# EasyEDA Pro project ProProject_Hauptplatine_ESP32.epro, schematic Schematic1_Link
Create Date: 2024-03-31; Page Name: P1; Project Name: Hauptplatine_ESP32; Schematic Name: Schematic1_Link; Update Date: 2024-06-12; Company: EasyEDA.com; Drawn: EasyEDA; Page Size: A4; Part Number: JLCPCB-002; Reviewed: EasyEDA; Version: V0.1
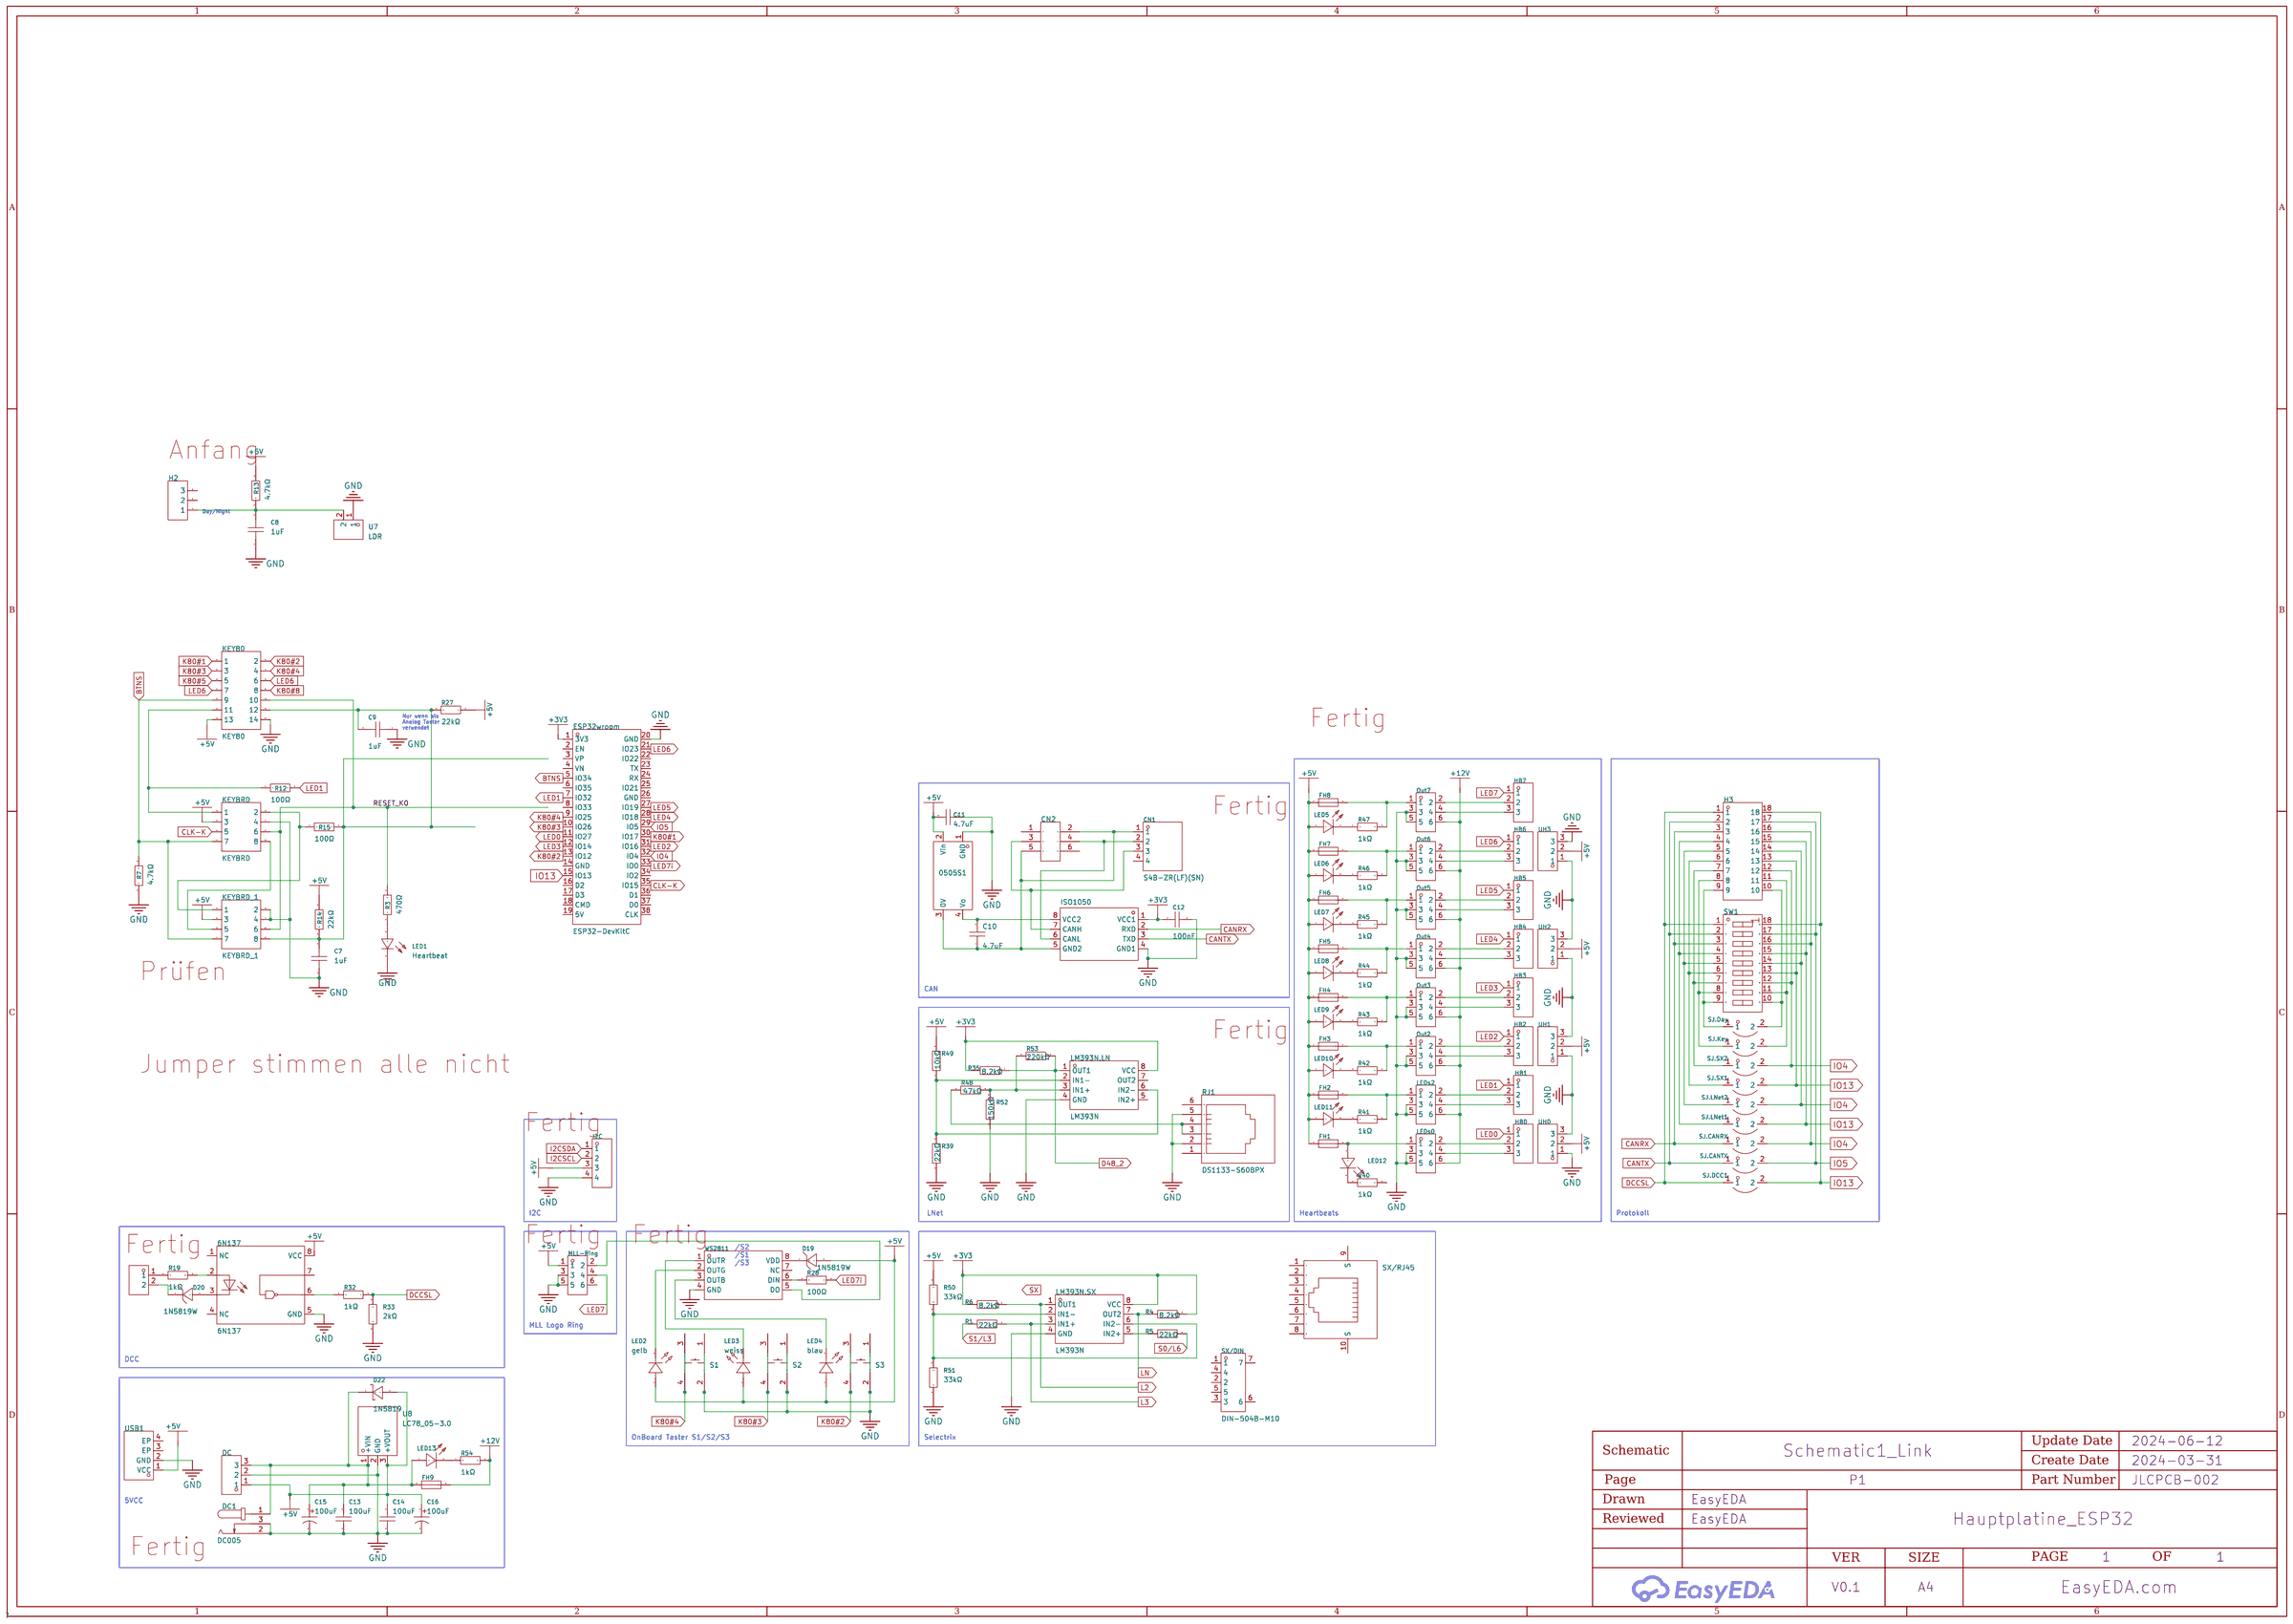
[diagram p7: schematic sheet]

## Parts
6N137  6N137  [DIP-8_L9.8-W6.6-P2.54-LS7.6-BL]
0505S1  B0505S-W5R3  [PWRM-TH_BXXXXS-1WR3]
C7  1uF  [C1206]
C8  1uF  [C1206]
C9  1uF  [C1206]
C10  4.7uF  [C1206]
C11  4.7uF  [C1206]
C12  100nF  [C1206]
C13  100uF  [C1206]
C14  100uF  [C1206]
C15  100uF  [CAP-SMD_BD6.3-L6.6-W6.6-FD]
C16  100uF  [CAP-SMD_BD6.3-L6.6-W6.6-FD]
CN1  S4B-ZR(LF)(SN)  [CONN-TH_S4B-ZR-LF-SN]
CN2  2.54-2*3P弯简牛  [IDC-TH_6P-P2.54-H-R2-C3-S2.54]
D19  1N5819W  [SOD-123_L2.8-W1.8-LS3.7-RD]
D20  1N5819W  [SOD-123_L2.8-W1.8-LS3.7-RD]
D22  1N5819  [SMA_L4.4-W2.6-LS5.0-RD]
DC  DB2ERC-3.5-3P-GN  [CONN-TH_3P-P3.50_DB2ERC-3.5-3P-GN]
DC1  DC005  [DC-IN-TH_DC005]
DCC1  DB2ERC-3.5-2P-GN  [CONN-TH_2P-P3.50_DB2ERC-3.5-2P]
ESP32wroom  ESP32-DevKitC  [BULETM-SMD_ESP32-DEVKITC]
FH1  01550900M  [FUSE-SMD_L9.8-W5.0]
FH2  01550900M  [FUSE-SMD_L9.8-W5.0]
FH3  01550900M  [FUSE-SMD_L9.8-W5.0]
FH4  01550900M  [FUSE-SMD_L9.8-W5.0]
FH5  01550900M  [FUSE-SMD_L9.8-W5.0]
FH6  01550900M  [FUSE-SMD_L9.8-W5.0]
FH7  01550900M  [FUSE-SMD_L9.8-W5.0]
FH8  01550900M  [FUSE-SMD_L9.8-W5.0]
FH9  01550900M  [FUSE-SMD_L9.8-W5.0]
H2  2.54-1*3P针  [HDR-TH_3P-P2.54-V-M-1]
H3  X6521WV-2x09H-C60D30  [HDR-TH_18P-P2.54-V-M-R2-C9-S2.54]
HB0  PM2.54-1*3  [HDR-TH_3P-P2.54-V-F]
HB1  PM2.54-1*3  [HDR-TH_3P-P2.54-V-F]
HB2  PM2.54-1*3  [HDR-TH_3P-P2.54-V-F]
HB3  PM2.54-1*3  [HDR-TH_3P-P2.54-V-F]
HB4  PM2.54-1*3  [HDR-TH_3P-P2.54-V-F]
HB5  PM2.54-1*3  [HDR-TH_3P-P2.54-V-F]
HB6  PM2.54-1*3  [HDR-TH_3P-P2.54-V-F]
HB7  PM2.54-1*3  [HDR-TH_3P-P2.54-V-F]
I2C  2.54-1*4P母  [HDR-TH_4P-P2.54-V-F]
ISO1050  ISO1050DUBR  [SOIC-8_L9.3-W6.6-P2.54-LS10.4-BL]
KEY80  KEY80  [IDC-TH_14P-P2.54-V-R2-C7-S2.54]
KEYBRD  KEYBRD  [IDC-TH_8P-P2.54-V-R2-C4-S2.54]
KEYBRD_1  KEYBRD_1  [IDC-TH_8P-P2.54-V-R2-C4-S2.54]
LED1  Heartbeat  [LED-TH_BD3.0-P2.54-FD-GREEN]
LED2  gelb  [LED-TH_BD3.0-P2.54-FD_YELLOW]
LED3  weiss  [LED-TH_BD3.8-P2.54-FD_WHITE]
LED4  blau  [LED-TH_BD3.8-P2.54-FD_BLUE]
LED5  gelb  [LED-TH_BD3.0-P2.54-FD]
LED6  gelb  [LED-TH_BD3.0-P2.54-FD]
LED7  gelb  [LED-TH_BD3.0-P2.54-FD]
LED8  gelb  [LED-TH_BD3.0-P2.54-FD]
LED9  gelb  [LED-TH_BD3.0-P2.54-FD]
LED10  gelb  [LED-TH_BD3.0-P2.54-FD]
LED11  gelb  [LED-TH_BD3.0-P2.54-FD]
LED12  gelb  [LED-TH_BD3.0-P2.54-FD]
LED13  gelb  [LED-TH_BD3.0-P2.54-FD]
LEDs0  BH254V-6P  [IDC-TH_6P-P2.54-V-R2-C3-S2.54]
LEDs2  BH254V-6P  [IDC-TH_6P-P2.54-V-R2-C3-S2.54]
LM393N.LN  LM393N  [DIP-8_L9.7-W6.4-P2.54-LS7.6-BL]
LM393N.SX  LM393N  [DIP-8_L9.7-W6.4-P2.54-LS7.6-BL]
MLL-Ring  BH254V-6P  [IDC-TH_6P-P2.54-V-R2-C3-S2.54]
Out2  BH254V-6P  [IDC-TH_6P-P2.54-V-R2-C3-S2.54]
Out3  BH254V-6P  [IDC-TH_6P-P2.54-V-R2-C3-S2.54]
Out4  BH254V-6P  [IDC-TH_6P-P2.54-V-R2-C3-S2.54]
Out5  BH254V-6P  [IDC-TH_6P-P2.54-V-R2-C3-S2.54]
Out6  BH254V-6P  [IDC-TH_6P-P2.54-V-R2-C3-S2.54]
Out7  BH254V-6P  [IDC-TH_6P-P2.54-V-R2-C3-S2.54]
R1  22kΩ  [R1206]
R3  470Ω  [R1206]
R4  8.2kΩ  [R1206]
R5  22kΩ  [R1206]
R6  8.2kΩ  [R1206]
R7  4.7kΩ  [R1206]
R12  100Ω  [R1206]
R13  4.7kΩ  [R1206]
R14  22kΩ  [R1206]
R15  100Ω  [R1206]
R19  1kΩ  [R1206]
R27  22kΩ  [R1206]
R28  100Ω  [R1206]
R32  1kΩ  [R1206]
R33  2kΩ  [R1206]
R35  8.2kΩ  [R1206]
R39  22kΩ  [R1206]
R40  1kΩ  [R1206]
R41  1kΩ  [R1206]
R42  1kΩ  [R1206]
R43  1kΩ  [R1206]
R44  1kΩ  [R1206]
R45  1kΩ  [R1206]
R46  1kΩ  [R1206]
R47  1kΩ  [R1206]
R48  47kΩ  [R1206]
R49  10kΩ  [R1206]
R50  33kΩ  [R1206]
R51  33kΩ  [R1206]
R52  150kΩ  [R1206]
R53  220kΩ  [R1206]
R54  1kΩ  [R1206]
RJ1  DS1133-S60BPX  [RJ11-TH_DS1133-S60BPX]
S1  K2-1102DP-X4SW-04  [KEY-TH_4P-L6.2-W6.2-P4.50-LS6.5]
S2  K2-1102DP-X4SW-04  [KEY-TH_4P-L6.2-W6.2-P4.50-LS6.5]
S3  K2-1102DP-X4SW-04  [KEY-TH_4P-L6.2-W6.2-P4.50-LS6.5]
SJ.CANRX  SJ_1.27  [SMD_2P-P1.27-SJ]
SJ.CANTX  SJ_1.27  [SMD_2P-P1.27-SJ]
SJ.Day  SJ_1.27  [SMD_2P-P1.27-SJ]
SJ.DCC1  SJ_1.27  [SMD_2P-P1.27-SJ]
SJ.Key  SJ_1.27  [SMD_2P-P1.27-SJ]
SJ.LNet1  SJ_1.27  [SMD_2P-P1.27-SJ]
SJ.LNet2  SJ_1.27  [SMD_2P-P1.27-SJ]
SJ.SX1  SJ_1.27  [SMD_2P-P1.27-SJ]
SJ.SX2  SJ_1.27  [SMD_2P-P1.27-SJ]
SW1  DS-09RP  [SW-TH_18P-L24.4-W9.9-P2.54-LS7.6]
SX/DIN  DIN-504B-M10  [CONN-TH_DIN-504B-M10]
SX/RJ45  R-RJ45R08P-B000  [RJ45-TH_R-RJ45R08P-B000]
U7  LDR  [CONN-TH_2P-P2.54_DEALON_DW254W-11-02-85]
U8  LC78_05-3.0  [PWRM-TH_LC78_05-3.0]
UH0  PM2.54-1*3  [HDR-TH_3P-P2.54-V-F]
UH1  PM2.54-1*3  [HDR-TH_3P-P2.54-V-F]
UH2  PM2.54-1*3  [HDR-TH_3P-P2.54-V-F]
UH3  PM2.54-1*3  [HDR-TH_3P-P2.54-V-F]
USB1  KH-TYPE-C-2P  [USB-SMD_KH-TYPE-C-2P]
WS2811  WS2811  [SOP-8_L4.9-W3.9-P1.27-LS6.0-BL]

## Library data of the parts
6N137 = 6N137_C142297: Number of Channels:1 Isolation Voltage:5000V Input Type:DC Common Mode Transient Immunity (CMTI):- Data Rate:10Mbit/s Propagation Delay tpLH/tpHL:75ns,75ns Supply Voltage:- Supply Voltage:- Operating Temperature:-40℃~+85℃ Operating Temperature:-40℃~+85℃; Supplier Part: C142297; Manufacturer: EVERLIGHT(亿光); Supplier Footprint: DIP-8; JLCPCB Part Class: Extended Part; Datasheet: https://atta.szlcsc.com/upload/public/pdf/source/20171110/C142297_15102792608691104240.PDF; Supplier: LCSC; Number of Channels: 1; Isolation Voltage: 5000V; Input Type: DC; Data Rate: 10Mbit/s; Propagation Delay tpLH/tpHL: 75ns,75ns; Operating Temperature: -40℃~+85℃
0505S1 = B0505S-W5R3: Conversion Type:DC-DC Input Voltage(DC):5V Input Voltage(DC):5V Output Voltage:5V Output Voltage:5V Output Power:0.5W Output Current (Max):100mA Output Current (Max):100mA Isolation or not:隔离 Output Channel:1 Insulated Voltage:1500V Conversion Efficiency:; LCSC Part Name: 电源模块; Supplier Part: C882275; Manufacturer: VISOM; Supplier Footprint: 插件; JLCPCB Part Class: Extended Part; Datasheet: https://atta.szlcsc.com/upload/public/pdf/source/20201103/C882275_F211E11AECA51B401D8F665BA96E9160.pdf; Supplier: LCSC; Conversion Type: DC-DC; Input Voltage(DC): 5V; Output Voltage: 5V; Output Power: 0.5W; Output Current (Max): 100mA; Isolation or not: 隔离; Output Channel: 1; Insulated Voltage: 1500V; Conversion Efficiency: 80%; Feature: Short-Circuit Protection; Maximum Capacitive Load: 220uF
C7-C9 = CL31B105KCHNNNE: Capacitance: Tolerance:±10% Tolerance:±10% Voltage Rated: Temperature Coefficient:; LCSC Part Name: 1uF ±10% 100V; Supplier Part: C13832; Manufacturer: SAMSUNG(三星); Supplier Footprint: 1206; JLCPCB Part Class: Extended Part; Datasheet: https://atta.szlcsc.com/upload/public/pdf/source/20160218/1457707763339.pdf; Supplier: LCSC; Tolerance: ±10%
C10 C11 = CL31B475KAHNNNE: Capacitance: Tolerance:±10% Tolerance:±10% Voltage Rated: Temperature Coefficient:; LCSC Part Name: 4.7uF ±10% 25V; Supplier Part: C1872; Manufacturer: SAMSUNG(三星); Supplier Footprint: 1206; JLCPCB Part Class: Extended Part; Datasheet: https://atta.szlcsc.com/upload/public/pdf/source/20160218/1457707763339.pdf; Supplier: LCSC; Tolerance: ±10%
C12 = CC1206KKX7R0BB104: Capacitance: Tolerance:±10% Tolerance:±10% Voltage Rated: Temperature Coefficient:; LCSC Part Name: 100nF ±10% 100V; Supplier Part: C107181; Manufacturer: YAGEO(国巨); Supplier Footprint: 1206; JLCPCB Part Class: Extended Part; Datasheet: https://atta.szlcsc.com/upload/public/pdf/source/20180906/C282243_51A53A5345E69C6665D4E8CFC2B98E68.pdf; Supplier: LCSC; Tolerance: ±10%
C13 C14 = CL31A107MQHNNNE: Capacitance: Tolerance:±20% Tolerance:±20% Voltage Rated: Temperature Coefficient:; LCSC Part Name: 100uF ±20% 6.3V; Supplier Part: C15008; Manufacturer: SAMSUNG(三星); Supplier Footprint: 1206; JLCPCB Part Class: Basic Part; Datasheet: https://atta.szlcsc.com/upload/public/pdf/source/20160218/1457707763339.pdf; Supplier: LCSC; Tolerance: ±20%
C15 C16 = RVT1E101M0607_C72477: Capacitance: Tolerance:±20% Tolerance:±20% Rated Voltage: Ripple Current:93mA@120Hz Equivalent Series Resistance(ESR):- φD: L: Lifetime @ Temp:2000hrs@105℃ Operating Temperature:-40℃~+105℃ Operating Temperature:-40℃~+105℃; LCSC Part Name: 100uF ±20% 25V; Supplier Part: C72477; Manufacturer: ROQANG(容强); Manufacturer Part: RVT1E101M0607; Supplier Footprint: SMD,D6.3xL7.7mm; JLCPCB Part Class: Extended Part; Datasheet: https://atta.szlcsc.com/upload/public/pdf/source/20170325/1490427950282.pdf; Supplier: LCSC; Tolerance: ±20%; Ripple Current: 93mA@120Hz; Lifetime @ Temp: 2000hrs@105℃; Operating Temperature: -40℃~+105℃
CN1 = S4B-ZR(LF)(SN): Pins Structure:1x4P Pitch:1.5mm Mounting Style:Right-Angle Reference Series:ZH Number of Pins:4P Number of Rows:1 Number of PINs Per Row:4 Row Spacing:- Contact Material:Brass; LCSC Part Name: 系列:ZH 间距:1.5mm 1x4P; Supplier Part: C157924; Manufacturer: JST; Supplier Footprint: 弯插,P=1.5mm; JLCPCB Part Class: Extended Part; Datasheet: https://atta.szlcsc.com/upload/public/pdf/source/20181010/C265435_265A0E364DE7AFA8D888C9DA34FBB2A6.pdf; Supplier: LCSC; Pins Structure: 1x4P; Pitch: 1.5mm; Mounting Style: Right-Angle; Reference Series: ZH; Number of Pins: 4P; Number of Rows: 1; Number of PINs Per Row: 4; Contact Material: Brass
CN2 = 2.54-2*3P弯简牛: Connector Type:简牛座 Pitch:2.54mm Structure:2x3P Holder Type:Right-Angle Row Spacing:2.54mm Number of Rows:2 Pin Number in each Row:3 Contact Material:- Contact Plating:-; LCSC Part Name: 2.54mm 2x3P 排数:2 每排P数:3; Supplier Part: C34945; Manufacturer: BOOMELE(博穆精密); Supplier Footprint: 弯插,P=2.54mm; JLCPCB Part Class: Extended Part; Datasheet: https://atta.szlcsc.com/upload/public/pdf/source/20151118/1457707580629.pdf; Supplier: LCSC; Connector Type: 简牛座; Pitch: 2.54mm; Structure: 2x3P; Holder Type: Right-Angle; Row Spacing: 2.54mm; Number of Rows: 2; Pin Number in each Row: 3
D19 D20 = 1N5819W_C402219: Forward Voltage (Vf@If):900mV@3A Reverse Voltage (Vr):40V Average Rectified Current (Io):1A; LCSC Part Name: 电压:40V 电流:1A; Supplier Part: C402219; Manufacturer: LGE(鲁光); Supplier Footprint: SOD-123; JLCPCB Part Class: Extended Part; Datasheet: https://atta.szlcsc.com/upload/public/pdf/source/20190705/C402219_2009EA3D7FB00C8B1236866A0C573AC9.pdf; Supplier: LCSC; Forward Voltage (Vf@If): 900mV@3A; Reverse Voltage (Vr): 40V; Average Rectified Current (Io): 1A
D22 = 1N5819_C437199: Forward Voltage (Vf@If):500mV@1A Reverse Voltage (Vr):40V Average Rectified Current (Io):1A; LCSC Part Name: 电压:40V 电流:1A; Supplier Part: C437199; Manufacturer: KEXIN(科信); Supplier Footprint: DO-214AC(SMA); JLCPCB Part Class: Extended Part; Datasheet: https://atta.szlcsc.com/upload/public/pdf/source/20191012/C437199_83583E622A6684E767605E43C169C596.pdf; Supplier: LCSC; Forward Voltage (Vf@If): 500mV@1A; Reverse Voltage (Vr): 40V; Average Rectified Current (Io): 1A
DC = DB2ERC-3.5-3P-GN: Connector Type:板端/Receptacle-Close Structure:1x3P Pitch:3.5mm Color:Green Mounting Style:Bend Number of Pins:3P Number of Rows:1 Number of PINs Per Row:3 Current Rating (Max):10A Voltage Rating (Max):250V Operating Temperature Range:-40℃~+105℃ Operating T; LCSC Part Name: 3.5mm 1x3P 排数:1 每排P数:3; Supplier Part: C430551; Manufacturer: DORABO(地博电气); Supplier Footprint: 弯插,P=3.5mm; JLCPCB Part Class: Extended Part; Datasheet: https://atta.szlcsc.com/upload/public/pdf/source/20190923/C430575_06246F5F3B4A2DABA2F1121ECAE9A082.pdf; Supplier: LCSC; Connector Type: 板端/Receptacle-Close; Structure: 1x3P; Pitch: 3.5mm; Color: Green; Mounting Style: Bend; Number of Pins: 3P; Number of Rows: 1; Number of PINs Per Row: 3; Current Rating (Max): 10A; Voltage Rating (Max): 250V; Operating Temperature Range: -40℃~+105℃
DC1 = DC005: Connector Type:DC Power Receptacle Mounting Style:Right-Angle Inside Contact Diameter:2mm Outside Contact Diameter:6.3mm Current Rating (Max):500mA Voltage Rating (Max):30V Operating Temperature Range:-40℃~+55℃ Operating Temperature Range:-40℃~+55℃; LCSC Part Name: DC电源插座 内径:2mm 外径:6.3mm; Supplier Part: C431533; Manufacturer: SHOU HAN(首韩); Supplier Footprint: 插件; JLCPCB Part Class: Extended Part; Datasheet: https://atta.szlcsc.com/upload/public/pdf/source/20190925/C431533_4751811035784AC1D38EBC85F7905E99.pdf; Supplier: LCSC; Connector Type: DC Power Receptacle; Mounting Style: Right-Angle; Inside Contact Diameter: 2mm; Outside Contact Diameter: 6.3mm; Current Rating (Max): 500mA; Voltage Rating (Max): 30V; Operating Temperature Range: -40℃~+55℃
DCC1 = DB2ERC-3.5-2P-GN: Connector Type:板端/Receptacle-Close Pitch:3.5mm Structure:1x2P Number of Rows:1 Number of PINs Per Row:2 Number of Pins:2P Current Rating (Max):10A Voltage Rating (Max):250V Operating Temperature Range:-40℃~+105℃ Operating Temperature Range:-40℃~+105℃ Colo; LCSC Part Name: 3.5mm 1x2P 排数:1 每排P数:2; Supplier Part: C395830; Manufacturer: DIBO(地博电气); Supplier Footprint: 弯插,P=3.5mm; JLCPCB Part Class: Extended Part; Datasheet: https://atta.szlcsc.com/upload/public/pdf/source/20230327/B3D6220F4540DBC069FF6ECCFA34901A.pdf; Supplier: LCSC; Connector Type: 板端/Receptacle-Close; Pitch: 3.5mm; Structure: 1x2P; Number of Rows: 1; Number of PINs Per Row: 2; Number of Pins: 2P; Current Rating (Max): 10A; Voltage Rating (Max): 250V; Operating Temperature Range: -40℃~+105℃; Color: Green; Mounting Style: Bend
ESP32wroom = ESP32-DevKitC: CPU:- ROM Size:- Number of I/O: USB:- WIFI Protocols:- Bluetooth:- Ethernet:- Audio & Video Interface:- Multimedia Support:- Card Type:- Power Supply Type:- Power Supply:- POE Support:- Resolution:- Temperature Range:-; LCSC Part Name: 开发板; Supplier Part: C571180; Manufacturer: ESPRESSIF(乐鑫); JLCPCB Part Class: Extended Part; Datasheet: https://atta.szlcsc.com/upload/public/pdf/source/20200521/C529586_D6FCDAFCFF160B3EDDF7DF28D600699D.pdf; Supplier: LCSC
FH1-FH9 = 01550900M: Fuseholder Type:- Fuse Type:- Fuse Size:-; Supplier Part: C108518; Manufacturer: Littelfuse(美国力特); Supplier Footprint: SMD,5.0x9.7mm; JLCPCB Part Class: Extended Part; Datasheet: https://atta.szlcsc.com/upload/public/pdf/source/20181031/C315847_D8C8759CD5ED576C0EA975A2D5312378.pdf; Supplier: LCSC
H2 = 2.54-1*3P针: Pin Structure:1x3P Pitch:2.54mm Row Spacing:- Circluar Pins/Square Pins:Square Pins Mounting Type:Straight Number of Rows:Plugin Number of Pins:3P Current Rating (Max):3A Voltage Rating (Max):- Length of Mating Pin:- Insulation Height:- Length of End Conn; LCSC Part Name: 间距:2.54mm 1x3P 直插 方针; Supplier Part: C49257; Manufacturer: BOOMELE(博穆精密); Supplier Footprint: 插件,P=2.54mm; JLCPCB Part Class: Extended Part; Datasheet: https://atta.szlcsc.com/upload/public/pdf/source/20221018/3E9408392E35E6F57A28985E5F7BF5C9.pdf; Supplier: LCSC; Pin Structure: 1x3P; Pitch: 2.54mm; Circluar Pins/Square Pins: Square Pins; Mounting Type: Straight; Number of Rows: Plugin; Number of Pins: 3P; Current Rating (Max): 3A; Operating Temperature Range: -40℃~+105℃; Color: Black
H3 = X6521WV-2x09H-C60D30: Pin Structure:2x9P Pitch:2.54mm Row Spacing:2.54mm Circluar Pins/Square Pins:Square Pins Mounting Type:- Number of Rows:双排 Number of Pins:18P Current Rating (Max):3A Voltage Rating (Max):250V Length of Mating Pin:6mm Insulation Height:2.5mm Length of End; LCSC Part Name: 2x9P 间距:2.54mm 方针; Supplier Part: C706899; Manufacturer: XKB Connection(中国星坤); Supplier Footprint: 插件,P=2.54mm; JLCPCB Part Class: Extended Part; Datasheet: https://atta.szlcsc.com/upload/public/pdf/source/20211009/DE33EBA4104B5B447A7BD8383FBBA145.pdf; Supplier: LCSC; Pin Structure: 2x9P; Pitch: 2.54mm; Row Spacing: 2.54mm; Circluar Pins/Square Pins: Square Pins; Number of Rows: 双排; Number of Pins: 18P; Current Rating (Max): 3A; Voltage Rating (Max): 250V; Length of Mating Pin: 6mm; Insulation Height: 2.5mm; Length of End Connection Pin: 3mm; Contact Plating: Gold; Operating Temperature Range: -40℃~+105℃; Soldering Temperature(Max): 260℃; Color: Black
HB0-HB7 UH0-UH3 = PM2.54-1*3: Holes Structure:1x3P Pitch:2.54mm Row Spacing:2.54mm Circular Hole / Square Hole:方孔 Mounting Type:Straight Number of Rows:Plugin Number of Holes:3P Current Rating (Max):2.5A Holes Direction:Top Insulation Height:8.5mm Operating Temperature Range:-40℃~+105; LCSC Part Name: 间距:2.54mm 1x3P 直插; Supplier Part: C5116529; Manufacturer: ZHOURI(洲日); Supplier Footprint: 插件,P=2.54mm; JLCPCB Part Class: Extended Part; Datasheet: https://atta.szlcsc.com/upload/public/pdf/source/20220729/0B9CDCB2053AD78CED9CDFEF888323E9.pdf; Supplier: LCSC; Holes Structure: 1x3P; Pitch: 2.54mm; Row Spacing: 2.54mm; Circular Hole / Square Hole: 方孔; Mounting Type: Straight; Number of Rows: Plugin; Number of Holes: 3P; Current Rating (Max): 2.5A; Holes Direction: Top; Insulation Height: 8.5mm; Operating Temperature Range: -40℃~+105℃
I2C = 2.54-1*4P母: Holes Structure:1x4P Pitch:2.54mm Row Spacing:- Circular Hole / Square Hole:Square Holes Mounting Type:Straight Number of Rows:Plugin Number of Holes:4P Current Rating (Max):3A Voltage Rating (Max):- Holes Direction:Top Insulation Height:- Contact Materia; LCSC Part Name: 间距:2.54mm 1x4P 直插; Supplier Part: C2718488; Manufacturer: BOOMELE(博穆精密); Supplier Footprint: 插件,P=2.54mm; JLCPCB Part Class: Extended Part; Datasheet: https://atta.szlcsc.com/upload/public/pdf/source/20210301/C2718488_F4427B881E42CAA8DDB0B1C12B3A522C.pdf; Supplier: LCSC; Holes Structure: 1x4P; Pitch: 2.54mm; Circular Hole / Square Hole: Square Holes; Mounting Type: Straight; Number of Rows: Plugin; Number of Holes: 4P; Current Rating (Max): 3A; Holes Direction: Top; Contact Material: bronze; Operating Temperature Range: -40℃~+105℃
ISO1050 = ISO1050DUBR: Type:Transceiver；隔离器 Data Rate:1Mbps Supply Voltage:3V~5.5V Supply Voltage:3V~5.5V Operating Temperature:-55℃~+105℃ Operating Temperature:-55℃~+105℃; LCSC Part Name: 1Mbps 3V~5.5V; Supplier Part: C16428; Manufacturer: TI(德州仪器); Supplier Footprint: SOP-8; JLCPCB Part Class: Extended Part; Datasheet: https://www.ti.com/cn/lit/gpn/iso1050; Supplier: LCSC; Type: Transceiver；隔离器; Data Rate: 1Mbps; Supply Voltage: 3V~5.5V; Operating Temperature: -55℃~+105℃
KEY80 = 2.54-2*7P简牛: Connector Type:简牛座 Pitch:2.54mm Structure:2x7P Holder Type:Straight Row Spacing:2.54mm Number of Rows:2 Pin Number in each Row:7 Contact Material:Brass Contact Plating:Gold; LCSC Part Name: 2.54mm 2x7P 排数:2 每排P数:7; Supplier Part: C11215; Manufacturer: BOOMELE(博穆精密); Supplier Footprint: 插件,P=2.54mm; JLCPCB Part Class: Extended Part; Datasheet: https://atta.szlcsc.com/upload/public/pdf/source/20131122/1457706661483.pdf; Supplier: LCSC; Connector Type: 简牛座; Pitch: 2.54mm; Structure: 2x7P; Holder Type: Straight; Row Spacing: 2.54mm; Number of Rows: 2; Pin Number in each Row: 7; Contact Material: Brass; Contact Plating: Gold
KEYBRD KEYBRD_1 = 2.54-2*4P简牛: Connector Type:简牛座 Pitch:2.54mm Structure:2x4P Holder Type:Straight Row Spacing:2.54mm Number of Rows:2 Pin Number in each Row:4 Contact Material:- Contact Plating:-; LCSC Part Name: 2.54mm 2x4P 排数:2 每排P数:4; Supplier Part: C9135; Manufacturer: BOOMELE(博穆精密); Supplier Footprint: 插件,P=2.54mm; JLCPCB Part Class: Extended Part; Datasheet: https://atta.szlcsc.com/upload/public/pdf/source/20131122/1457706661483.pdf; Supplier: LCSC; Connector Type: 简牛座; Pitch: 2.54mm; Structure: 2x4P; Holder Type: Straight; Row Spacing: 2.54mm; Number of Rows: 2; Pin Number in each Row: 4
LED1 = 204-10SUGD/S400-A5: Lamp Holder Type:3mm圆形灯头 Emitted Color:Emerald Power Dissipation:110mW Forward Current:20mA Dominant Wavelength:530nm Dominant Wavelength:530nm Peak Wavelength:525nm Diode Configuration:- Lens Color:雾状绿透镜 Color Temperature:- Color Temperature:- Viewing An; LCSC Part Name: 翠绿; Supplier Part: C99761; Manufacturer: EVERLIGHT(亿光); Supplier Footprint: 插件,D=3mm; JLCPCB Part Class: Extended Part; Datasheet: https://atta.szlcsc.com/upload/public/pdf/source/20231222/11ECFE5D50388BB9885CDCD9350FD859.pdf; Supplier: LCSC; Lamp Holder Type: 3mm圆形灯头; Emitted Color: Emerald; Power Dissipation: 110mW; Forward Current: 20mA; Dominant Wavelength: 530nm; Peak Wavelength: 525nm; Lens Color: 雾状绿透镜; Viewing Angle: 30°; Operating Temperature: -40℃~+85℃
LED2 = TZ-L2-03YYBY2YDJ30-001: Lamp Holder Type:3mm圆形灯头 Emitted Color:Yellow Power Dissipation:60mW Forward Current:20mA Dominant Wavelength:590nm~595nm Dominant Wavelength:590nm~595nm Peak Wavelength:- Diode Configuration:- Lens Color:黄色透镜 Color Temperature:- Color Temperature:- Viewi; LCSC Part Name: 黄灯; Supplier Part: C779430; Manufacturer: TUOZHAN(拓展光电); Supplier Footprint: 插件,D=3mm; JLCPCB Part Class: Extended Part; Datasheet: https://atta.szlcsc.com/upload/public/pdf/source/20200925/C779430_863756D6554513B1EB57F7A850CA2A03.pdf; Supplier: LCSC; Lamp Holder Type: 3mm圆形灯头; Emitted Color: Yellow; Power Dissipation: 60mW; Forward Current: 20mA; Dominant Wavelength: 590nm~595nm; Lens Color: 黄色透镜; Viewing Angle: 30°; Operating Temperature: -20℃~+75℃
LED3 = XL-302UWC: Lamp Holder Type:3mm圆形灯头 Emitted Color:White Power Dissipation:80mW Forward Current:20mA Lens Color:无色透明透镜 Color Temperature:6000K~6500K Color Temperature:6000K~6500K Viewing Angle:50° Mounting Sytle:- Operating Temperature:-25℃~+85℃ Operating Temperature; Supplier Part: C2895458; Manufacturer: XINGLIGHT(成兴光); Supplier Footprint: 插件,D=3mm; JLCPCB Part Class: Extended Part; Datasheet: https://atta.szlcsc.com/upload/public/pdf/source/20240112/543BCCAC3CB93518E6AD22EB07A95060.pdf; Supplier: LCSC; Lamp Holder Type: 3mm圆形灯头; Emitted Color: White; Power Dissipation: 80mW; Forward Current: 20mA; Lens Color: 无色透明透镜; Color Temperature: 6000K~6500K; Viewing Angle: 50°; Operating Temperature: -25℃~+85℃
LED4 = XL-302UBD: Lamp Holder Type:3mm圆形灯头 Emitted Color:Blue Power Dissipation:80mW Forward Current:30mA Dominant Wavelength:455nm~460nm Dominant Wavelength:455nm~460nm Peak Wavelength:465nm Lens Color:蓝色透镜 Color Temperature:- Color Temperature:- Viewing Angle:50° Mountin; Supplier Part: C2895474; Manufacturer: XINGLIGHT(成兴光); Supplier Footprint: 插件,D=3mm; JLCPCB Part Class: Extended Part; Datasheet: https://atta.szlcsc.com/upload/public/pdf/source/20240112/D32096FD17ADF843BFE6A9D946368B54.pdf; Supplier: LCSC; Lamp Holder Type: 3mm圆形灯头; Emitted Color: Blue; Power Dissipation: 80mW; Forward Current: 30mA; Dominant Wavelength: 455nm~460nm; Peak Wavelength: 465nm; Lens Color: 蓝色透镜; Viewing Angle: 50°; Operating Temperature: -25℃~+85℃
LED5-LED13 = MHL3014GTS: Lamp Holder Type:3mm圆形灯头 Emitted Color:Green-yellow Power Dissipation:78mW Forward Current:20mA Dominant Wavelength:570nm Dominant Wavelength:570nm Peak Wavelength:572nm Diode Configuration:- Lens Color:雾状白透镜 Color Temperature:- Color Temperature:- Viewin; LCSC Part Name: 普绿/黄绿; Supplier Part: C397054; Manufacturer: MEIHUA(美华); Supplier Footprint: 插件,D=3mm; JLCPCB Part Class: Extended Part; Datasheet: https://atta.szlcsc.com/upload/public/pdf/source/20190613/C397054_81FF8A379DDCAE47426055BE42C5DA0E.pdf; Supplier: LCSC; Lamp Holder Type: 3mm圆形灯头; Emitted Color: Green-yellow; Power Dissipation: 78mW; Forward Current: 20mA; Dominant Wavelength: 570nm; Peak Wavelength: 572nm; Lens Color: 雾状白透镜; Viewing Angle: 40°; Operating Temperature: -25℃~+85℃
LEDs0 LEDs2 MLL-Ring Out2-Out7 = BH254V-6P: Connector Type:简牛座 Pitch:2.54mm Structure:2x3P Current Rating (Max):3A Voltage Rating (Max):250V Holder Type:Straight Row Spacing:2.54mm Number of Rows:2 Pin Number in each Row:3 Operating Temperature Range:-40℃~+105℃ Operating Temperature Range:-40℃~+105; LCSC Part Name: 2.54mm 2x3P 排数:2 每排P数:3; Supplier Part: C492441; Manufacturer: XFCN(兴飞); Supplier Footprint: 插件,P=2.54mm; JLCPCB Part Class: Extended Part; Datasheet: https://atta.szlcsc.com/upload/public/pdf/source/20200312/C492444_4AABE2FC4F6BE8226B85135616AF0092.pdf; Supplier: LCSC; Connector Type: 简牛座; Pitch: 2.54mm; Structure: 2x3P; Current Rating (Max): 3A; Voltage Rating (Max): 250V; Holder Type: Straight; Row Spacing: 2.54mm; Number of Rows: 2; Pin Number in each Row: 3; Operating Temperature Range: -40℃~+105℃
LM393N.LN LM393N.SX = LM393N: LCSC Part Name: 双路差动比较器; Supplier Part: C725322; Manufacturer: HGSEMI(华冠); Supplier Footprint: DIP-8; JLCPCB Part Class: Extended Part; Datasheet: https://atta.szlcsc.com/upload/public/pdf/source/20200820/C725322_C46EBBBE971B817B9F055C15254D1754.pdf; Supplier: LCSC
R1 R5 R14 R27 R39 = 1206W4F2202T5E: Type:Thick Film Resistors Resistance:22kΩ Tolerance:±1% Tolerance:±1% Power(Watts): Overload Voltage (Max): Temperature Coefficient:±100ppm/℃ Temperature Coefficient:±100ppm/℃ Operating Temperature Range:-55℃~+155℃ Operating Temperature Range:-55℃~+155℃; LCSC Part Name: 22kΩ ±1% 250mW 厚膜电阻; Supplier Part: C25830; Manufacturer: UNI-ROYAL(厚声); Supplier Footprint: 1206; JLCPCB Part Class: Extended Part; Datasheet: https://atta.szlcsc.com/upload/public/pdf/source/20200306/C422600_1E6D84923E4A46A82E41ADD87F860B5C.pdf; Supplier: LCSC; Type: Thick Film Resistors; Tolerance: ±1%; Temperature Coefficient: ±100ppm/℃; Operating Temperature Range: -55℃~+155℃
R3 = 1206W4F4700T5E: Type:Thick Film Resistors Resistance: Tolerance:±1% Tolerance:±1% Power(Watts): Overload Voltage (Max): Temperature Coefficient:±100ppm/℃ Temperature Coefficient:±100ppm/℃ Operating Temperature Range:-55℃~+155℃ Operating Temperature Range:-55℃~+155℃; LCSC Part Name: 470Ω ±1% 250mW 厚膜电阻; Supplier Part: C4502; Manufacturer: UNI-ROYAL(厚声); Supplier Footprint: 1206; JLCPCB Part Class: Extended Part; Datasheet: https://atta.szlcsc.com/upload/public/pdf/source/20200306/C422600_1E6D84923E4A46A82E41ADD87F860B5C.pdf; Supplier: LCSC; Type: Thick Film Resistors; Tolerance: ±1%; Temperature Coefficient: ±100ppm/℃; Operating Temperature Range: -55℃~+155℃
R4 R6 R35 = 1206W4F8201T5E: Type:Thick Film Resistors Resistance:8.2kΩ Tolerance:±1% Tolerance:±1% Power(Watts): Overload Voltage (Max): Temperature Coefficient:±100ppm/℃ Temperature Coefficient:±100ppm/℃ Operating Temperature Range:-55℃~+155℃ Operating Temperature Range:-55℃~+155℃; LCSC Part Name: 8.2kΩ ±1% 250mW 厚膜电阻; Supplier Part: C18027; Manufacturer: UNI-ROYAL(厚声); Supplier Footprint: 1206; JLCPCB Part Class: Extended Part; Datasheet: https://atta.szlcsc.com/upload/public/pdf/source/20200306/C422600_1E6D84923E4A46A82E41ADD87F860B5C.pdf; Supplier: LCSC; Type: Thick Film Resistors; Tolerance: ±1%; Temperature Coefficient: ±100ppm/℃; Operating Temperature Range: -55℃~+155℃
R7 R13 = 1206W4F4701T5E: Type:Thick Film Resistors Resistance:4.7kΩ Tolerance:±1% Tolerance:±1% Power(Watts): Overload Voltage (Max): Temperature Coefficient:±100ppm/℃ Temperature Coefficient:±100ppm/℃ Operating Temperature Range:-55℃~+155℃ Operating Temperature Range:-55℃~+155℃; LCSC Part Name: 4.7kΩ ±1% 250mW 厚膜电阻; Supplier Part: C17936; Manufacturer: UNI-ROYAL(厚声); Supplier Footprint: 1206; JLCPCB Part Class: Basic Part; Datasheet: https://atta.szlcsc.com/upload/public/pdf/source/20200306/C422600_1E6D84923E4A46A82E41ADD87F860B5C.pdf; Supplier: LCSC; Type: Thick Film Resistors; Tolerance: ±1%; Temperature Coefficient: ±100ppm/℃; Operating Temperature Range: -55℃~+155℃
R12 R15 R28 = 1206W4F1000T5E_C17901: Type:Thick Film Resistors Resistance: Tolerance:±1% Tolerance:±1% Power(Watts): Overload Voltage (Max): Temperature Coefficient:±100ppm/℃ Temperature Coefficient:±100ppm/℃ Operating Temperature Range:-55℃~+155℃ Operating Temperature Range:-55℃~+155℃; LCSC Part Name: 100Ω ±1% 250mW 厚膜电阻; Supplier Part: C17901; Manufacturer: UNI-ROYAL(厚声); Manufacturer Part: 1206W4F1000T5E; Supplier Footprint: 1206; JLCPCB Part Class: Basic Part; Datasheet: https://atta.szlcsc.com/upload/public/pdf/source/20200306/C422600_1E6D84923E4A46A82E41ADD87F860B5C.pdf; Supplier: LCSC; Type: Thick Film Resistors; Tolerance: ±1%; Temperature Coefficient: ±100ppm/℃; Operating Temperature Range: -55℃~+155℃
R19 R32 R40-R47 R54 = 1206W4F1001T5E_C4410: Resistance:1000Ω Tolerance:±1% Tolerance:±1% Power(Watts): Overload Voltage (Max): Type:Thick Film Resistors Operating Temperature Range:-55℃~+155℃ Operating Temperature Range:-55℃~+155℃; LCSC Part Name: 1kΩ ±1% 250mW 厚膜电阻; Supplier Part: C4410; Manufacturer: UNI-ROYAL(厚声); Manufacturer Part: 1206W4F1001T5E; Supplier Footprint: 1206; JLCPCB Part Class: Basic Part; Datasheet: https://atta.szlcsc.com/upload/public/pdf/source/20200306/C422600_1E6D84923E4A46A82E41ADD87F860B5C.pdf; Supplier: LCSC; Tolerance: ±1%; Type: Thick Film Resistors; Operating Temperature Range: -55℃~+155℃
R33 = 1206W4F2001T5E: Type:Thick Film Resistors Resistance:2kΩ Tolerance:±1% Tolerance:±1% Power(Watts): Overload Voltage (Max): Temperature Coefficient:±100ppm/℃ Temperature Coefficient:±100ppm/℃ Operating Temperature Range:-55℃~+155℃ Operating Temperature Range:-55℃~+155℃; LCSC Part Name: 2kΩ ±1% 250mW 厚膜电阻; Supplier Part: C17944; Manufacturer: UNI-ROYAL(厚声); Supplier Footprint: 1206; JLCPCB Part Class: Basic Part; Datasheet: https://atta.szlcsc.com/upload/public/pdf/source/20200306/C422600_1E6D84923E4A46A82E41ADD87F860B5C.pdf; Supplier: LCSC; Type: Thick Film Resistors; Tolerance: ±1%; Temperature Coefficient: ±100ppm/℃; Operating Temperature Range: -55℃~+155℃
R48 = 1206W4F4702T5E: Type:Thick Film Resistors Resistance:47kΩ Tolerance:±1% Tolerance:±1% Power(Watts): Overload Voltage (Max): Temperature Coefficient:±100ppm/℃ Temperature Coefficient:±100ppm/℃ Operating Temperature Range:-55℃~+155℃ Operating Temperature Range:-55℃~+155℃; LCSC Part Name: 47kΩ ±1% 250mW 厚膜电阻; Supplier Part: C25833; Manufacturer: UNI-ROYAL(厚声); Supplier Footprint: 1206; JLCPCB Part Class: Extended Part; Datasheet: https://atta.szlcsc.com/upload/public/pdf/source/20200306/C422600_1E6D84923E4A46A82E41ADD87F860B5C.pdf; Supplier: LCSC; Type: Thick Film Resistors; Tolerance: ±1%; Temperature Coefficient: ±100ppm/℃; Operating Temperature Range: -55℃~+155℃
R49 = 1206W4F1002T5E: Type:Thick Film Resistors Resistance:10kΩ Tolerance:±1% Tolerance:±1% Power(Watts): Overload Voltage (Max): Temperature Coefficient:±100ppm/℃ Temperature Coefficient:±100ppm/℃ Operating Temperature Range:-55℃~+155℃ Operating Temperature Range:-55℃~+155℃; LCSC Part Name: 10kΩ ±1% 250mW 厚膜电阻; Supplier Part: C17902; Manufacturer: UNI-ROYAL(厚声); Supplier Footprint: 1206; JLCPCB Part Class: Basic Part; Datasheet: https://atta.szlcsc.com/upload/public/pdf/source/20200306/C422600_1E6D84923E4A46A82E41ADD87F860B5C.pdf; Supplier: LCSC; Type: Thick Film Resistors; Tolerance: ±1%; Temperature Coefficient: ±100ppm/℃; Operating Temperature Range: -55℃~+155℃
R50 R51 = 1206W4F3302T5E: Type:Thick Film Resistors Resistance:33kΩ Tolerance:±1% Tolerance:±1% Power(Watts): Overload Voltage (Max): Temperature Coefficient:±100ppm/℃ Temperature Coefficient:±100ppm/℃ Operating Temperature Range:-55℃~+155℃ Operating Temperature Range:-55℃~+155℃; LCSC Part Name: 33kΩ ±1% 250mW 厚膜电阻; Supplier Part: C18004; Manufacturer: UNI-ROYAL(厚声); Supplier Footprint: 1206; JLCPCB Part Class: Extended Part; Datasheet: https://atta.szlcsc.com/upload/public/pdf/source/20200306/C422600_1E6D84923E4A46A82E41ADD87F860B5C.pdf; Supplier: LCSC; Type: Thick Film Resistors; Tolerance: ±1%; Temperature Coefficient: ±100ppm/℃; Operating Temperature Range: -55℃~+155℃
R52 = 1206W4F1503T5E: Type:Thick Film Resistors Resistance:150kΩ Tolerance:±1% Tolerance:±1% Power(Watts): Overload Voltage (Max): Temperature Coefficient:±100ppm/℃ Temperature Coefficient:±100ppm/℃ Operating Temperature Range:-55℃~+155℃ Operating Temperature Range:-55℃~+155℃; LCSC Part Name: 150kΩ ±1% 250mW 厚膜电阻; Supplier Part: C17916; Manufacturer: UNI-ROYAL(厚声); Supplier Footprint: 1206; JLCPCB Part Class: Extended Part; Datasheet: https://atta.szlcsc.com/upload/public/pdf/source/20200306/C422600_1E6D84923E4A46A82E41ADD87F860B5C.pdf; Supplier: LCSC; Type: Thick Film Resistors; Tolerance: ±1%; Temperature Coefficient: ±100ppm/℃; Operating Temperature Range: -55℃~+155℃
R53 = 1206W4F2203T5E: Type:Thick Film Resistors Resistance:220kΩ Tolerance:±1% Tolerance:±1% Power(Watts): Overload Voltage (Max): Temperature Coefficient:±100ppm/℃ Temperature Coefficient:±100ppm/℃ Operating Temperature Range:-55℃~+155℃ Operating Temperature Range:-55℃~+155℃; LCSC Part Name: 220kΩ ±1% 250mW 厚膜电阻; Supplier Part: C17956; Manufacturer: UNI-ROYAL(厚声); Supplier Footprint: 1206; JLCPCB Part Class: Extended Part; Datasheet: https://atta.szlcsc.com/upload/public/pdf/source/20200306/C422600_1E6D84923E4A46A82E41ADD87F860B5C.pdf; Supplier: LCSC; Type: Thick Film Resistors; Tolerance: ±1%; Temperature Coefficient: ±100ppm/℃; Operating Temperature Range: -55℃~+155℃
RJ1 = DS1133-S60BPX: Connector Type:RJReceptacle USOC Codes:RJ12 Number of Ports:1 Shielding:- LED:- Ratings:-; LCSC Part Name: RJ12; Supplier Part: C77859; Manufacturer: CONNFLY; Supplier Footprint: 插件; JLCPCB Part Class: Extended Part; Datasheet: https://atta.szlcsc.com/upload/public/pdf/source/20180529/C77859_3164FC81ACC4F2D8B15A2684EF7DB4A9.pdf; Supplier: LCSC; Connector Type: RJReceptacle; USOC Codes: RJ12; Number of Ports: 1
S1-S3 = K2-1102DP-X4SW-04: Contact Current:50mA Voltage Rating (DC):12V Insulation Resistance:100MΩ Circuit:SPST Mounting Sytle:Straight Actuator Style:Round Button With Lamp:- Operating Force:250gf@±30gf Mechanical Life:100000 Operating Temperature:-25℃~+85℃ Operating Temperature:; Supplier Part: C136671; Manufacturer: 韩国韩荣; Supplier Footprint: 6x6mm; JLCPCB Part Class: Extended Part; Datasheet: https://atta.szlcsc.com/upload/public/pdf/source/20210810/D0CD9D77408EACA829A5E533AC6E5B1E.pdf; Supplier: LCSC; Contact Current: 50mA; Voltage Rating (DC): 12V; Insulation Resistance: 100MΩ; Circuit: SPST; Mounting Sytle: Straight; Actuator Style: Round Button; Operating Force: 250gf@±30gf; Mechanical Life: 100000; Operating Temperature: -25℃~+85℃; Switch Length: 6mm; Switch Width: 6mm; Switch Height: 17mm
SJ.CANRX SJ.CANTX SJ.Day SJ.DCC1 SJ.Key SJ.LNet1 SJ.LNet2 SJ.SX1 SJ.SX2 = SJ-raily74: Pin Structure:1x2P Pitch:1.27mm Row Spacing:1.27mm Circluar Pins/Square Pins:Square Pins Mounting Type:- Number of Rows:Plugin Number of Pins:2P Current Rating (Max):1A Voltage Rating (Max):250V Length of Mating Pin:1.8mm Insulation Height:1mm Length of E; LCSC Part Name: 1x2P 间距:1.27mm 方针; Supplier Part: C2881569; Manufacturer: XKB Connection(中国星坤); Supplier Footprint: SMD,P=1.27mm(交错脚); JLCPCB Part Class: Extended Part; Supplier: LCSC; Pin Structure: 1x2P; Pitch: 1.27mm; Row Spacing: 1.27mm; Circluar Pins/Square Pins: Square Pins; Number of Rows: Plugin; Number of Pins: 2P; Current Rating (Max): 1A; Voltage Rating (Max): 250V; Length of Mating Pin: 1.8mm; Insulation Height: 1mm; Length of End Connection Pin: 4.2mm; Contact Plating: Gold; Operating Temperature Range: -40℃~+105℃; Soldering Temperature(Max): 260℃; Color: Black
SW1 = DS-09RP_C458083: Type:平拨,凸起式 Circuit:SPST Number of Positions:9Bit Lead Pitch:2.54mm Current Rating:25mA Voltage Rating:24V Operating Temperature:-20℃~+70℃ Operating Temperature:-20℃~+70℃ Operating Life:3千次 Color:Red; LCSC Part Name: 间距2.54mm 平拨,凸起式 9位拨码开关; Supplier Part: C458083; Manufacturer: 韩国韩荣; Supplier Footprint: 插件; JLCPCB Part Class: Extended Part; Datasheet: https://atta.szlcsc.com/upload/public/pdf/source/20210810/ECF2F28B1CE673E7F9581E27682BDB10.pdf; Supplier: LCSC; Type: 平拨,凸起式; Circuit: SPST; Number of Positions: 9Bit; Lead Pitch: 2.54mm; Current Rating: 25mA; Voltage Rating: 24V; Operating Temperature: -20℃~+70℃; Operating Life: 3千次; Color: Red
SX/DIN = DIN-504B-M10: Supplier: LCSC; Supplier Part: C2939346; Manufacturer: HOOYA(皓宇电子); JLCPCB Part Class: Extended Part; Supplier Footprint: 插件; Datasheet: https://atta.szlcsc.com/upload/public/pdf/source/20220120/ABB2570656C6359DBC61E5C1017AC323.pdf
SX/RJ45 = R-RJ45R08P-B000: Connector Type:RJ45Receptacle Number of Ports:1 Mounting Style:Right-Angle Shielding:有屏蔽 LED:不带LED Ratings:- Operating Temperature Range:0℃~+70℃ Operating Temperature Range:0℃~+70℃; LCSC Part Name: 弯插 不带LED; Supplier Part: C386756; Manufacturer: Ckmtw(灿科盟); Supplier Footprint: 插件; JLCPCB Part Class: Extended Part; Datasheet: https://atta.szlcsc.com/upload/public/pdf/source/20190508/C386756_CEA064C28A6A9ED64075DA45BB64214F.pdf; Supplier: LCSC; Connector Type: RJ45Receptacle; Number of Ports: 1; Mounting Style: Right-Angle; Shielding: 有屏蔽; LED: 不带LED; Operating Temperature Range: 0℃~+70℃
U7 = DW254W-11-02-85: Holes Structure:1x2P Pitch:2.54mm Row Spacing:- Circular Hole / Square Hole:Square Holes Mounting Type:Right-Angle Number of Rows:Plugin Number of Holes:2P Current Rating (Max):3A Voltage Rating (Max):- Holes Direction:side Insulation Height:8.5mm Operati; LCSC Part Name: 间距:2.54mm 1x2P 弯插; Supplier Part: C2935992; Manufacturer: DEALON(德艺隆); Supplier Footprint: 弯插,P=2.54mm; JLCPCB Part Class: Extended Part; Datasheet: https://atta.szlcsc.com/upload/public/pdf/source/20211231/3C4D2E6B78ED2773EE45870C43BA2BC5.pdf; Supplier: LCSC; Holes Structure: 1x2P; Pitch: 2.54mm; Circular Hole / Square Hole: Square Holes; Mounting Type: Right-Angle; Number of Rows: Plugin; Number of Holes: 2P; Current Rating (Max): 3A; Holes Direction: side; Insulation Height: 8.5mm
U8 = LC78_05-3.0: Input Voltage(DC):6.5V~28V Input Voltage(DC):6.5V~28V Output Voltage:5V Output Voltage:5V Output Power:15W Output Current (Max):3A Output Current (Max):3A Output Channel:1 Conversion Efficiency:92% Conversion Efficiency:92%; Supplier Part: C6078609; Manufacturer: GAPTEC; Supplier Footprint: SIP,11.6x7.5mm; JLCPCB Part Class: Extended Part; Datasheet: https://atta.szlcsc.com/upload/public/pdf/source/231023/LC78_3.0.pdf-fa208ee5ba32f8bbc1c8628948d637b2.pdf; Supplier: LCSC; Input Voltage(DC): 6.5V~28V; Output Voltage: 5V; Output Power: 15W; Output Current (Max): 3A; Output Channel: 1; Conversion Efficiency: 92%
USB1 = KH-TYPE-C-2P: Connector Type:Type-C Standard:- Gender:- Number of Ports:- Number of Contacts:2P Mounting Style:- Current Rating - Power (Max):- Contact Material:- Contact Plating:- Operating Temperature Range:- Operating Temperature Range:-; LCSC Part Name: Type-C; Supplier Part: C2919656; Manufacturer: kinghelm(金航标); Supplier Footprint: 插件; JLCPCB Part Class: Extended Part; Datasheet: https://atta.szlcsc.com/upload/public/pdf/source/20220707/620587A9E0589B27D96D3CEE595CBC98.pdf; Supplier: LCSC; Connector Type: Type-C; Number of Contacts: 2P
WS2811 = WS2811: Type:- Input Voltage:- Input Voltage:- Switch Frequency:- Switch Frequency:- Channels:- Output Voltage:- Output Voltage:- Output Current:- Dimming:- Features:- Input Voltage(VAC):- Input Voltage(VAC):- Topology:- Operating temperature:- Operating temperat; Supplier Part: C114581; Manufacturer: worldsemi; Supplier Footprint: SOP-8; JLCPCB Part Class: Extended Part; Datasheet: https://atta.szlcsc.com/upload/public/pdf/source/20180423/C114581_D7EB4F7619FBAA371B1B7B79DFB248AC.pdf; Supplier: LCSC

## Nets
+3V3: C12.1 ESP32wroom.1(3V3) ISO1050.1(VCC1) LM393N.LN.8(VCC) LM393N.SX.8(VCC) R4.2 R6.1 R35.1
+5V: 6N137.8(VCC) 0505S1.2(Vin) C11.2 C14.2 C16.1 D19.2(A) D22.2(A) DC.1 FH1.1 FH2.1 FH3.1 FH4.1 FH5.1 FH6.1 FH7.1 FH8.1 I2C.3 KEY80.13 KEYBRD.3 KEYBRD_1.3 LED2.1(A) LED3.1(A) LED4.1(K) LED5.1(A) LED6.1(A) LED7.1(A) LED8.1(A) LED9.1(A) LED10.1(A) LED11.1(A) MLL-Ring.1 R13.2 R14.1 R27.1 R49.2 R50.2 U8.3(+VOUT) UH0.2 UH1.2 UH2.2 UH3.2 USB1.1(VCC)
+12V: FH9.2 LEDs0.6 LEDs2.6 Out2.6 Out3.6 Out4.6 Out5.6 Out6.6 Out7.6 R54.2
GND: 6N137.5(GND) 0505S1.1(GND) C7.1 C8.1 C9.1 C11.1 C12.2 C13.1 C14.1 C15.2 C16.2 DC.2 DC1.2 DC1.3 ESP32wroom.20(GND) I2C.4 ISO1050.4(GND1) KEY80.14 KEYBRD.4 KEYBRD_1.2 KEYBRD_1.4 LED1.2(K) LEDs0.3 LEDs0.5 LEDs2.3 LEDs2.5 LM393N.LN.4(GND) LM393N.SX.4(GND) MLL-Ring.3 MLL-Ring.5 Out2.3 Out2.5 Out3.3 Out3.5 Out4.3 Out4.5 Out5.3 Out5.5 Out6.3 Out6.5 Out7.3 Out7.5 R7.1 R33.1 R39.1 R51.1 R52.1 RJ1.2 RJ1.5 S1.1 S1.2 S2.1 S2.2 S3.1 S3.2 U7.1 U8.2(GND) UH0.1 UH0.3 UH1.1 UH1.3 UH2.1 UH2.3 UH3.1 UH3.3 USB1.2(GND) WS2811.4(GND)
BTNS: ESP32wroom.5(IO34) KEY80.9 KEYBRD.7 KEYBRD_1.7 R7.2
CANRX: H3.3 ISO1050.2(RXD) SJ.CANRX.1 SW1.3(PIN3)
CANTX: H3.2 ISO1050.3(TXD) SJ.CANTX.1 SW1.2(PIN2)
CLK-K: ESP32wroom.35(IO15) KEYBRD.5
D48_2: LM393N.LN.1(OUT1) R35.2 R53.2
DCCSL: H3.1 R32.1 R33.2 SJ.DCC1.1 SW1.1(PIN1)
I2CSCL: I2C.2
I2CSDA: I2C.1
IO4: ESP32wroom.32(IO4) H3.12 H3.14 H3.16 SJ.CANRX.2 SJ.LNet2.2 SJ.SX2.2 SW1.12(PIN12) SW1.14(PIN14) SW1.16(PIN16)
IO5: ESP32wroom.29(IO5) H3.17 SJ.CANTX.2 SW1.17(PIN16)
IO13: ESP32wroom.15(IO13) H3.13 H3.15 H3.18 SJ.DCC1.2 SJ.LNet1.2 SJ.SX1.2 SW1.13(PIN13) SW1.15(PIN15) SW1.18(PIN16)
K80#1: ESP32wroom.30(IO17) KEY80.1
K80#2: ESP32wroom.13(IO12) KEY80.2 S3.3 S3.4
K80#3: ESP32wroom.10(IO26) KEY80.3 S2.3 S2.4
K80#4: ESP32wroom.9(IO25) KEY80.4 S1.3 S1.4
K80#5: KEY80.5
K80#8: KEY80.8
L2: LM393N.SX.1(OUT1) R6.2
L3: LM393N.SX.3(IN1+) R1.2
LED0: ESP32wroom.11(IO27) HB0.1
LED1: ESP32wroom.7(IO32) HB1.1 R12.2
LED2: ESP32wroom.31(IO16) HB2.1
LED3: ESP32wroom.12(IO14) HB3.1
LED4: ESP32wroom.28(IO18) HB4.1
LED5: ESP32wroom.27(IO19) HB5.1
LED6: ESP32wroom.21(IO23) HB6.1 KEY80.6 KEY80.7
LED7: HB7.1 MLL-Ring.4
LED7i: ESP32wroom.33(IO0) R28.2
LN: LM393N.SX.7(OUT2) R4.1
RESET_K0: KEY80.10 KEYBRD.6 KEYBRD_1.6 R3.2
S0/L6: R5.2
S1/L3: R1.1
$1N1189: 6N137.2(AN) R19.2
$1N1986: KEYBRD.2 KEYBRD_1.1 R15.1
$1N2750: KEY80.11 KEYBRD.1 R12.1
$1N3936: C8.2 H2.1 R13.1 U7.2
$1N11896: HB1.2 LEDs2.2
$1N11901: HB1.3 LEDs2.4
$1N11909: HB0.2 LEDs0.2
$1N11921: HB0.3 LEDs0.4
$1N12006: HB2.3 Out2.4
$1N12011: HB3.3 Out3.4
$1N12461: HB3.2 Out3.2
$1N12464: HB4.2 Out4.2
$1N12467: HB4.3 Out4.4
$1N12470: HB5.3 Out5.4
$1N12476: HB5.2 Out5.2
$1N12479: HB6.3 Out6.4
$1N12482: HB6.2 Out6.2
$1N12485: HB7.3 Out7.4
$1N12491: HB7.2 Out7.2
$1N12927: HB2.2 Out2.2
$1N17644: KEYBRD.8 KEYBRD_1.5
$1N18211: LED2.2(K) WS2811.2(OUTG)
$1N18215: LED3.2(K) WS2811.1(OUTR)
$1N18221: LED4.2(A) WS2811.3(OUTB)
$1N18270: D19.1(C) WS2811.8(VDD)
$1N18397: R28.1 WS2811.6(DIN)
$1N18861: MLL-Ring.2 WS2811.5(DO)
$1N20798: 6N137.3(CAT) D20.2(A)
$1N20802: D20.1(C) DCC1.2
$1N20805: DCC1.1 R19.1
$1N21156: C7.2 C9.2 KEY80.12 KEYBRD_1.8 R14.2 R15.2 R27.2
$1N60077: LM393N.SX.5(IN2+) R5.1
$1N60080: LM393N.SX.2(IN1-) LM393N.SX.6(IN2-) R50.1 R51.2
$1N68632: 0505S1.4(Vo) C10.2 ISO1050.8(VCC2)
$1N76782: 6N137.6(VOUT) R32.2
$1N80505: LM393N.LN.2(IN1-) LM393N.LN.6(IN2-) R39.2 R49.1
$1N80884: 0505S1.3(0V) C10.1 CN1.1 CN2.2 CN2.5 ISO1050.5(GND2)
$1N81054: CN1.3 CN2.3 ISO1050.7(CANH)
$1N91733: R48.1 RJ1.3 RJ1.4
$1N91816: LM393N.LN.3(IN1+) R48.2 R52.2 R53.1
$1N113351: FH2.2 LEDs2.1 R41.2
$1N113358: FH3.2 Out2.1 R42.2
$1N113365: FH4.2 Out3.1 R43.2
$1N113372: FH5.2 Out4.1 R44.2
$1N113379: FH6.2 Out5.1 R45.2
$1N113386: FH7.2 Out6.1 R46.2
$1N113393: FH8.2 Out7.1 R47.2
$1N117507: CN1.2 CN2.4 ISO1050.6(CANL)
$1N121831: LED5.2(K) R47.1
$1N121877: LED6.2(K) R46.1
$1N121923: LED7.2(K) R45.1
$1N121969: LED8.2(K) R44.1
$1N122015: LED9.2(K) R43.1
$1N122061: LED10.2(K) R42.1
$1N122107: LED11.2(K) R41.1
$1N122151: LED12.2(K) R40.1
$1N122237: LED13.2(K) R54.1
$1N122939: LED1.1(A) R3.1
$1N124047: C13.2 C15.1 D22.1(C) DC.3 DC1.1 FH9.1 LED13.1(A) U8.1(+VIN)
$1N136264: H3.9 SJ.Day.1 SW1.9(PIN9)
$1N136271: H3.10 SJ.Day.2 SW1.10(PIN10)
$1N136278: H3.11 SJ.Key.2 SW1.11(PIN11)
$1N136334: H3.8 SJ.Key.1 SW1.8(PIN8)
$1N136341: H3.7 SJ.SX2.1 SW1.7(PIN7)
$1N136348: H3.6 SJ.SX1.1 SW1.6(PIN6)
$1N136355: H3.5 SJ.LNet2.1 SW1.5(PIN5)
$1N136362: H3.4 SJ.LNet1.1 SW1.4(PIN4)
Net-(FH1-2): FH1.2 LED12.1(A) LEDs0.1

Not connected (* = marked no-connect by the designer): 6N137 1(NC) 4(NC) 7(VE); CN1 4; CN2 1 6; ESP32wroom 2(EN) 3(VP) 4(VN) 6(IO35) 8(IO33) 14(GND) 16(D2) 17(D3) 18(CMD) 19(5V) 22(IO22) 23(TX) 24(RX) 25(IO21) 26(GND) 34(IO2) 36(D1) 37(D0) 38(CLK); H2 2 3; LM393N.LN 5(IN2+) 7(OUT2); MLL-Ring 6; R40 2; RJ1 1 6; SX/DIN 1 2 3 4 5 6 7; SX/RJ45 1 2 3 4 5 6 7 8 9(S) 10(S); USB1 3(EP) 4(EP); WS2811 7(NC)

## Notes on the sheet
- Anfang
- Day/Night
- Nur wenn als
  Analog Taster
  verwendet
- Fertig
- Fertig
- Prüfen
- CAN
- Fertig
- Jumper stimmen alle nicht
- Fertig
- I2C
- LNet
- Heartbeats
- Protokoll
- Fertig
- Fertig
- Fertig
- /S2
  /S1
  /S3
- MLL Logo Ring
- DCC
- OnBoard Taster S1/S2/S3
- Selectrix
- 5VCC
- Fertig
